# EAGLE design lab_8 (EAGLE 9.6.2)
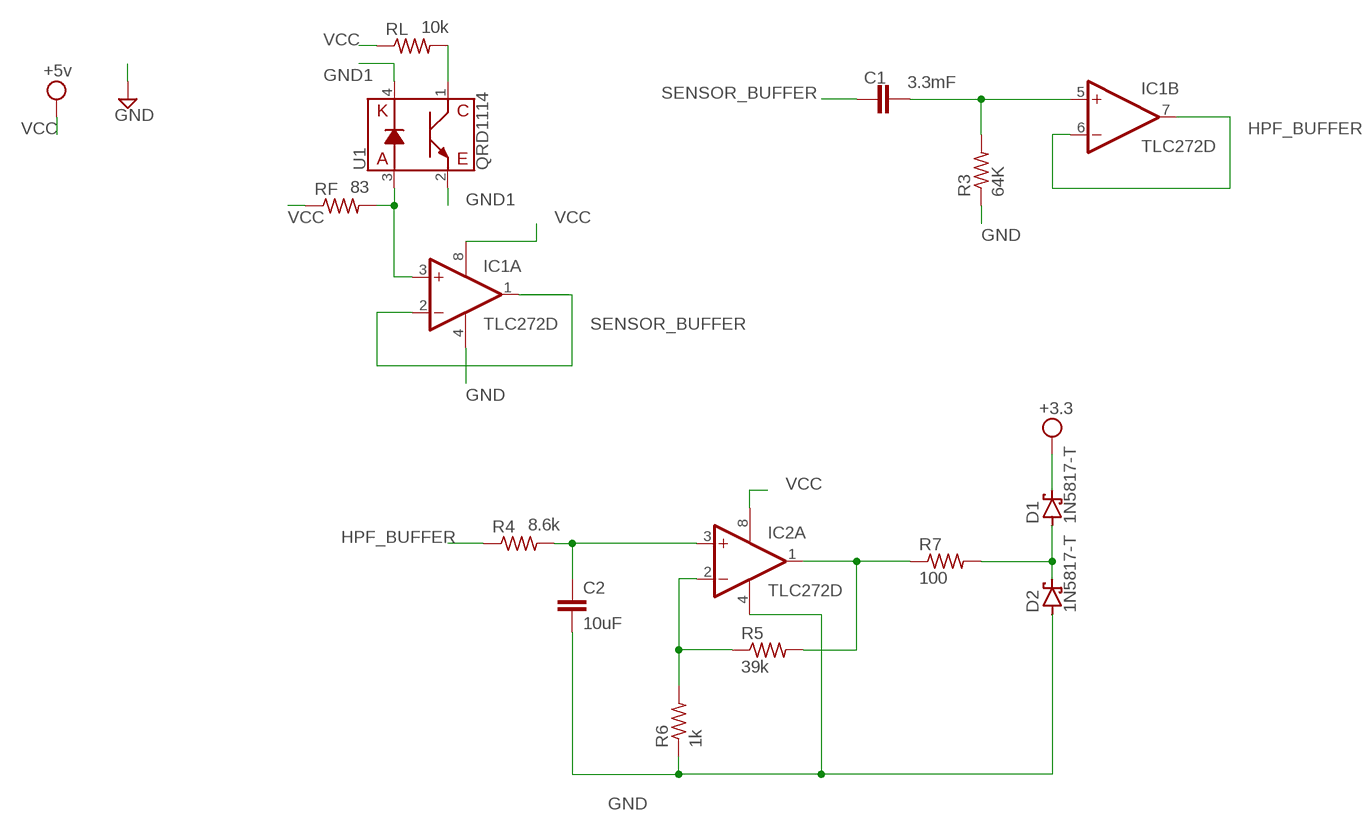
[diagram p0: schematic, sheet 1]

## Parts
C1  3.3mF  C-EU025-025X050  [C025-025X050]
C2  10uF  C-EU025-025X050  [C025-025X050]
D1  1N5817-T  [DO41-7.6]
D2  1N5817-T  [DO41-7.6]
IC1  TLC272D  [SO08]
IC2  TLC272D  [SO08]
R3  64K  R-US_R0805  [R0805]
R4  8.6k  R-US_R0805  [R0805]
R5  39k  R-US_R0805  [R0805]
R6  1k  R-US_R0805  [R0805]
R7  100  R-US_R0805  [R0805]
RF  83  R-US_R0805  [R0805]
RL  10k  R-US_R0805  [R0805]
U1  QRD1114  [QRD1114]

## Nets
GND: C2.2 D2.A IC1.4(P:V-) IC2.4(P:V-) R3.1 R6.1
GND1: U1.2(E) U1.4(K)
HPF_BUFFER: IC1.6(B:-IN) IC1.7(B:OUT) R4.1
N$1: C1.2 IC1.5(B:+IN) R3.2
N$2: C2.1 IC2.3(A:+IN) R4.2
N$3: IC1.3(A:+IN) RF.2 U1.3(A)
N$4: IC2.2(A:-IN) R5.1 R6.2
N$5: IC2.1(A:OUT) R5.2 R7.1
N$7: D1.A D2.C R7.2
SENSOR_BUFFER: C1.1 IC1.1(A:OUT) IC1.2(A:-IN)
VCC: D1.C IC1.8(P:V+) IC2.8(P:V+) RF.1 RL.1 RL.2 U1.1(C) ; supply symbol labelled +5v, +3.3
Unconnected: IC2.5(B:+IN) IC2.6(B:-IN) IC2.7(B:OUT)

## Library data of the parts
C1 C2 = rcl:C-EU: CAPACITOR, European symbol; SPICEPREFIX: C
D1 D2 = diode:1N581*: 1.0A SCHOTTKY BARRIER RECTIFIER Source: http://www.diodes.com/datasheets/ds23001.pdf
IC1 IC2 = linear:TLC272: OP AMP
R3-R7 RF RL = rcl:R-US_: RESISTOR, American symbol; SPICEPREFIX: R
U1 = SparkFun-Sensors:QRD1114: QRD1114 Reflective Proximity, Object Sensor This sensor uses an infrared emitted diode combined with an infrared phototransistor to detect the reflected infrared signal. Ideal for sensing black-to-white transitions or can be used to detect nearby objects (.5-1cm). Datasheet <http://www.sparkfun.com/datasheets/BOT/QRD1114.pdf> SparkFun Products Optical Detector / Phototransistor - QRD1114 <https://www.sparkfun.com/products/246> (SEN-00246); PROD_ID: IC-09032; SF_ID: SEN-00246

## Board
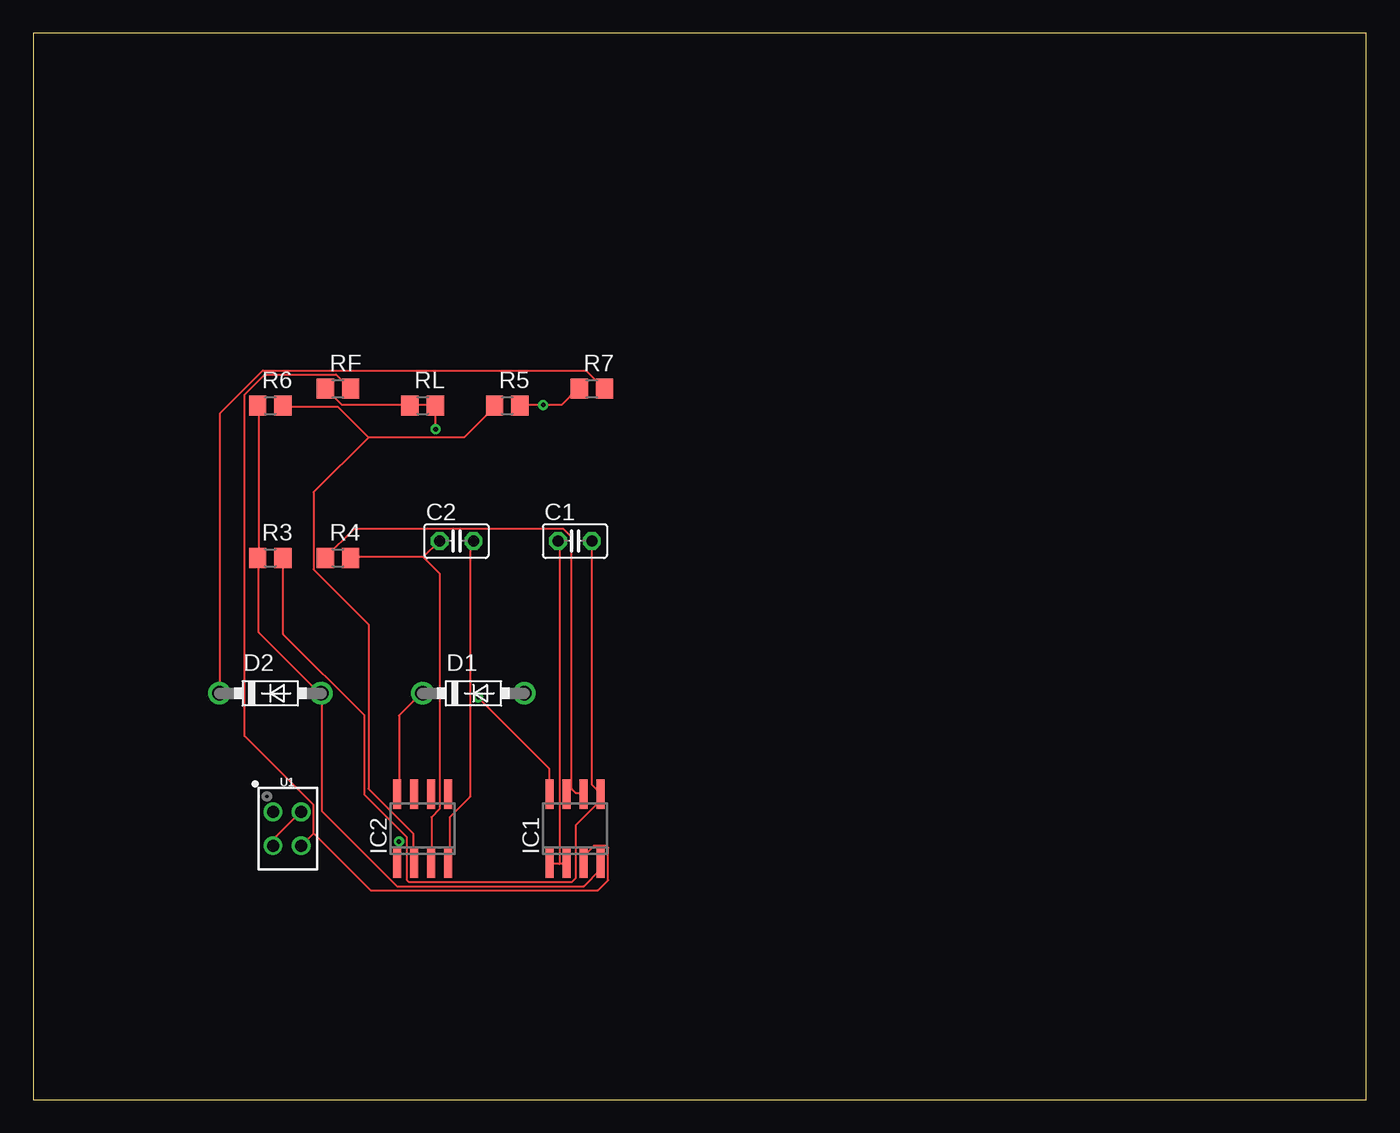
[diagram p1: board, top side]
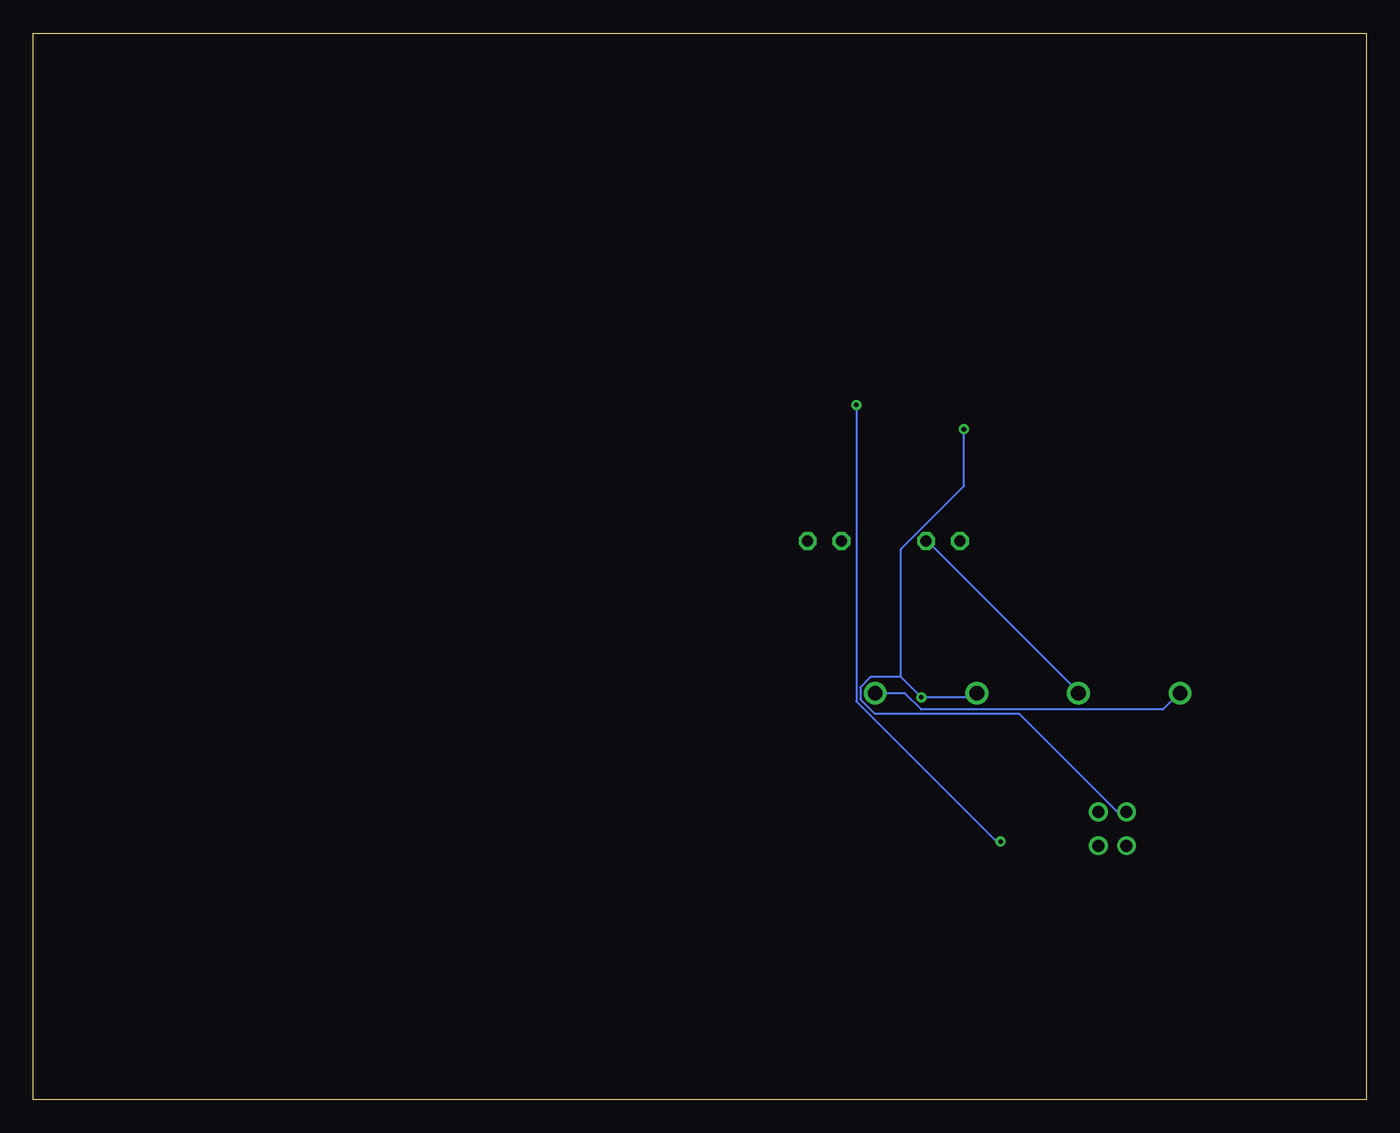
[diagram p2: board, bottom side, seen from below]

Size 100 x 80 mm. Coordinates in mm from the lower left corner, seen from the top.
Outline: 0,0 100,0 100,80 0,80 0,0
Copper layers (1*16): Top 0.035mm / dielectric 1.5mm / Bottom 0.035mm
Design rules "default": minimum track width 6mil, minimum drill 0.35mm, track to track 6mil, track to pad 6mil, pad to pad 6mil, via to via 6mil, smd to smd 6mil, copper to edge 40mil, drill to drill 6mil, minimum pad ring 10mil, minimum via ring 8mil, stop-mask expansion 4mil, vias tented up to drill 0mil, thermal gap 10mil

### Footprints (pad centres in the part's own frame; a part is rotated, then mirrored left to right if it is on the bottom)
C025-025X050 = drill 0.813 octagon: 1 -1.27,0; 2 1.27,0
DO41-7.6 = drill 1.1 pad 1.7: A 3.81,0; C -3.81,0
SO08 = smd 0.6 x 2.2: 1 -1.905,-2.6; 2 -0.635,-2.6; 3 0.635,-2.6; 4 1.905,-2.6; 5 1.905,2.6; 6 0.635,2.6; 7 -0.635,2.6; 8 -1.905,2.6
R0805 = smd 1.3 x 1.5: 1 -0.95,0; 2 0.95,0
QRD1114 = drill 0.9: 1 -1.067,1.27; 2 -1.067,-1.27; 3 1.041,-1.27; 4 1.041,1.27

### Placement (x,y rotation side)
C1  40.64,41.91 0 top
C2  31.75,41.91 0 top
D1  33.02,30.48 0 top
D2  17.78,30.48 0 top
IC1  40.64,20.32 0 top
IC2  29.21,20.32 0 top
R3  17.78,40.64 0 top
R4  22.86,40.64 0 top
R5  35.56,52.07 0 top
R6  17.78,52.07 0 top
R7  41.91,53.34 0 top
RF  22.86,53.34 0 top
RL  29.21,52.07 0 top
U1  19.05,20.32 0 top

### Tracks (layer width: path | path; a pad name or v marks a point on that pad's centre or on a via)
GND
  Top 0.152: IC2.4 31.24,17.83 31.24,21.18 32.77,22.71 32.77,41.76 32.92,41.91 C2.2 | R6.1 16.92,51.97 16.92,40.69 R3.1 16.92,40.54 16.92,35.05 21.49,30.48 D2.A 21.64,30.48 21.64,21.64 27.28,16 41.3,16 42.52,17.22 42.52,17.68 IC1.4
  Bottom 0.152: C2.2 32.92,41.91 21.49,30.48 D2.A
GND1
  Top 0.152: U1.2 17.98,19.51 19.96,21.49 U1.4
HPF_BUFFER
  Top 0.152: 40.39,23.32 40.39,42.22 39.78,42.82 24.08,42.82 21.95,40.69 R4.1 | 40.39,23.32 40.08,23.01 IC1.7 | 40.39,23.32 40.69,23.01 41.15,23.01 IC1.6
N$1
  Top 0.152: R3.2 18.75,40.54 18.75,34.9 24.84,28.8 24.84,22.86 28.04,19.66 28.04,16.46 28.19,16.31 40.39,16.31 40.69,16.61 40.69,20.57 42.52,22.4 42.52,22.86 IC1.5 42.52,23.01 41.91,23.62 C1.2
N$2
  Top 0.152: 29.26,40.69 23.93,40.69 R4.2 | C2.1 29.26,40.69 | 29.26,40.69 30.48,39.47 30.48,21.79 29.87,21.18 29.87,17.83 IC2.3
N$3
  Top 0.152: 21.03,19.96 21.03,22.1 15.85,27.28 15.85,52.88 17.37,54.41 22.71,54.41 23.77,53.34 RF.2 | 21.03,19.96 20.12,19.05 U1.3 | 21.03,19.96 25.3,15.7 42.37,15.7 43.13,16.46 43.13,18.9 42.98,19.05 42.06,19.05 41.3,18.29 41.3,17.83 IC1.3
N$4
  Top 0.152: 25.15,49.68 22.86,51.97 18.75,51.97 R6.2 | 25.15,49.68 32.31,49.68 34.59,51.97 R5.1 | 25.15,49.68 21.03,45.57 21.03,39.78 25.15,35.66 25.15,23.32 28.5,19.96 28.5,17.83 IC2.2
N$5  (via drill 0.35)
  Top 0.152: R5.2 36.58,52.12 v38.25,52.12 39.62,52.12 40.84,53.34 R7.1 | v27.43,19.36 27.43,17.83 IC2.1
  Bottom 0.152: v27.43,19.36 27.74,19.36 38.25,29.87 v38.25,52.12
N$7
  Top 0.152: R7.2 42.82,53.34 41.45,54.71 17.22,54.71 14.02,51.51 14.02,30.48 D2.C
  Bottom 0.152: D1.A 34.59,30.48 33.38,29.26 15.24,29.26 14.02,30.48 D2.C
SENSOR_BUFFER
  Top 0.152: 39.47,17.68 39.93,17.68 IC1.2 | 39.47,17.68 38.86,17.68 IC1.1 | 39.47,17.68 39.47,41.91 C1.1
VCC  (via drill 0.35)
  Top 0.152: RF.1 21.95,53.34 23.16,52.12 28.19,52.12 RL.1 28.35,52.12 30.02,52.12 RL.2 30.18,51.97 v30.18,50.29 | IC2.8 27.43,23.01 27.43,28.8 29.11,30.48 D1.C | v33.38,30.18 38.71,24.84 38.71,23.01 IC1.8
  Bottom 0.152: D1.C 29.26,30.48 29.57,30.18 v33.38,30.18 34.9,31.7 | 34.9,31.7 37.19,31.7 37.95,30.94 37.95,30.02 36.88,28.96 26.06,28.96 18.75,21.64 17.98,21.64 U1.1 | v30.18,50.29 30.18,46.02 34.9,41.3 34.9,31.7